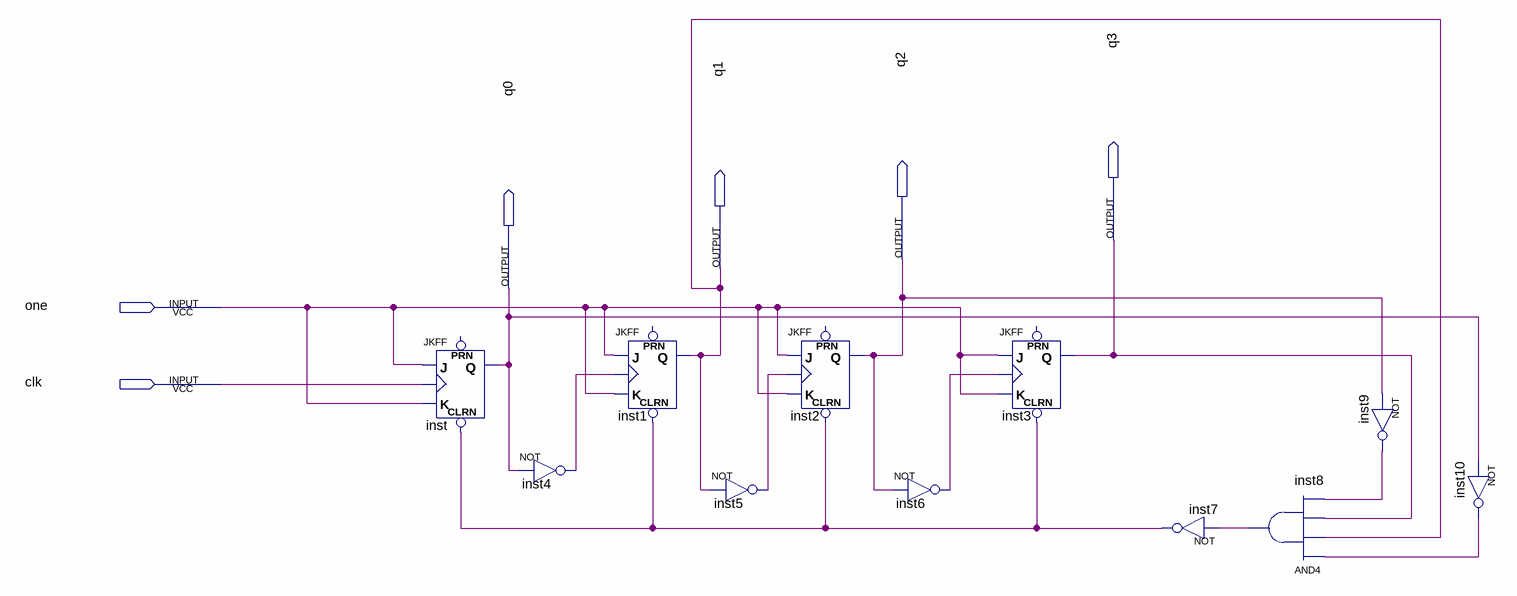
[diagram p0: schematic sheet]
// Quartus schematic contador0_9.bdf as structural Verilog: 11 symbols, 6 pins
module contador0_9 (
  input  one,
  input  clk,
  output q3,
  output q2,
  output q1,
  output q0
);

  wire inst4_out, inst5_out, inst6_out, inst7_out, inst8_out, inst9_out, inst10_out;

  JKFF inst (.CLRN(inst7_out), .K(one), .J(one), .CLK(clk), .Q(q0));  // open: PRN
  not inst4 (inst4_out, q0);
  JKFF inst1 (.CLRN(inst7_out), .K(one), .J(one), .CLK(inst4_out), .Q(q1));  // open: PRN
  not inst5 (inst5_out, q1);
  JKFF inst2 (.CLRN(inst7_out), .K(one), .J(one), .CLK(inst5_out), .Q(q2));  // open: PRN
  not inst6 (inst6_out, q2);
  JKFF inst3 (.CLRN(inst7_out), .K(one), .J(one), .CLK(inst6_out), .Q(q3));  // open: PRN
  not inst7 (inst7_out, inst8_out);
  and inst8 (inst8_out, inst10_out, q1, q3, inst9_out);
  not inst9 (inst9_out, q2);
  not inst10 (inst10_out, q0);
endmodule
